# EAGLE schematic moth_v3_54mm_breakout (EAGLE 9.6.2)
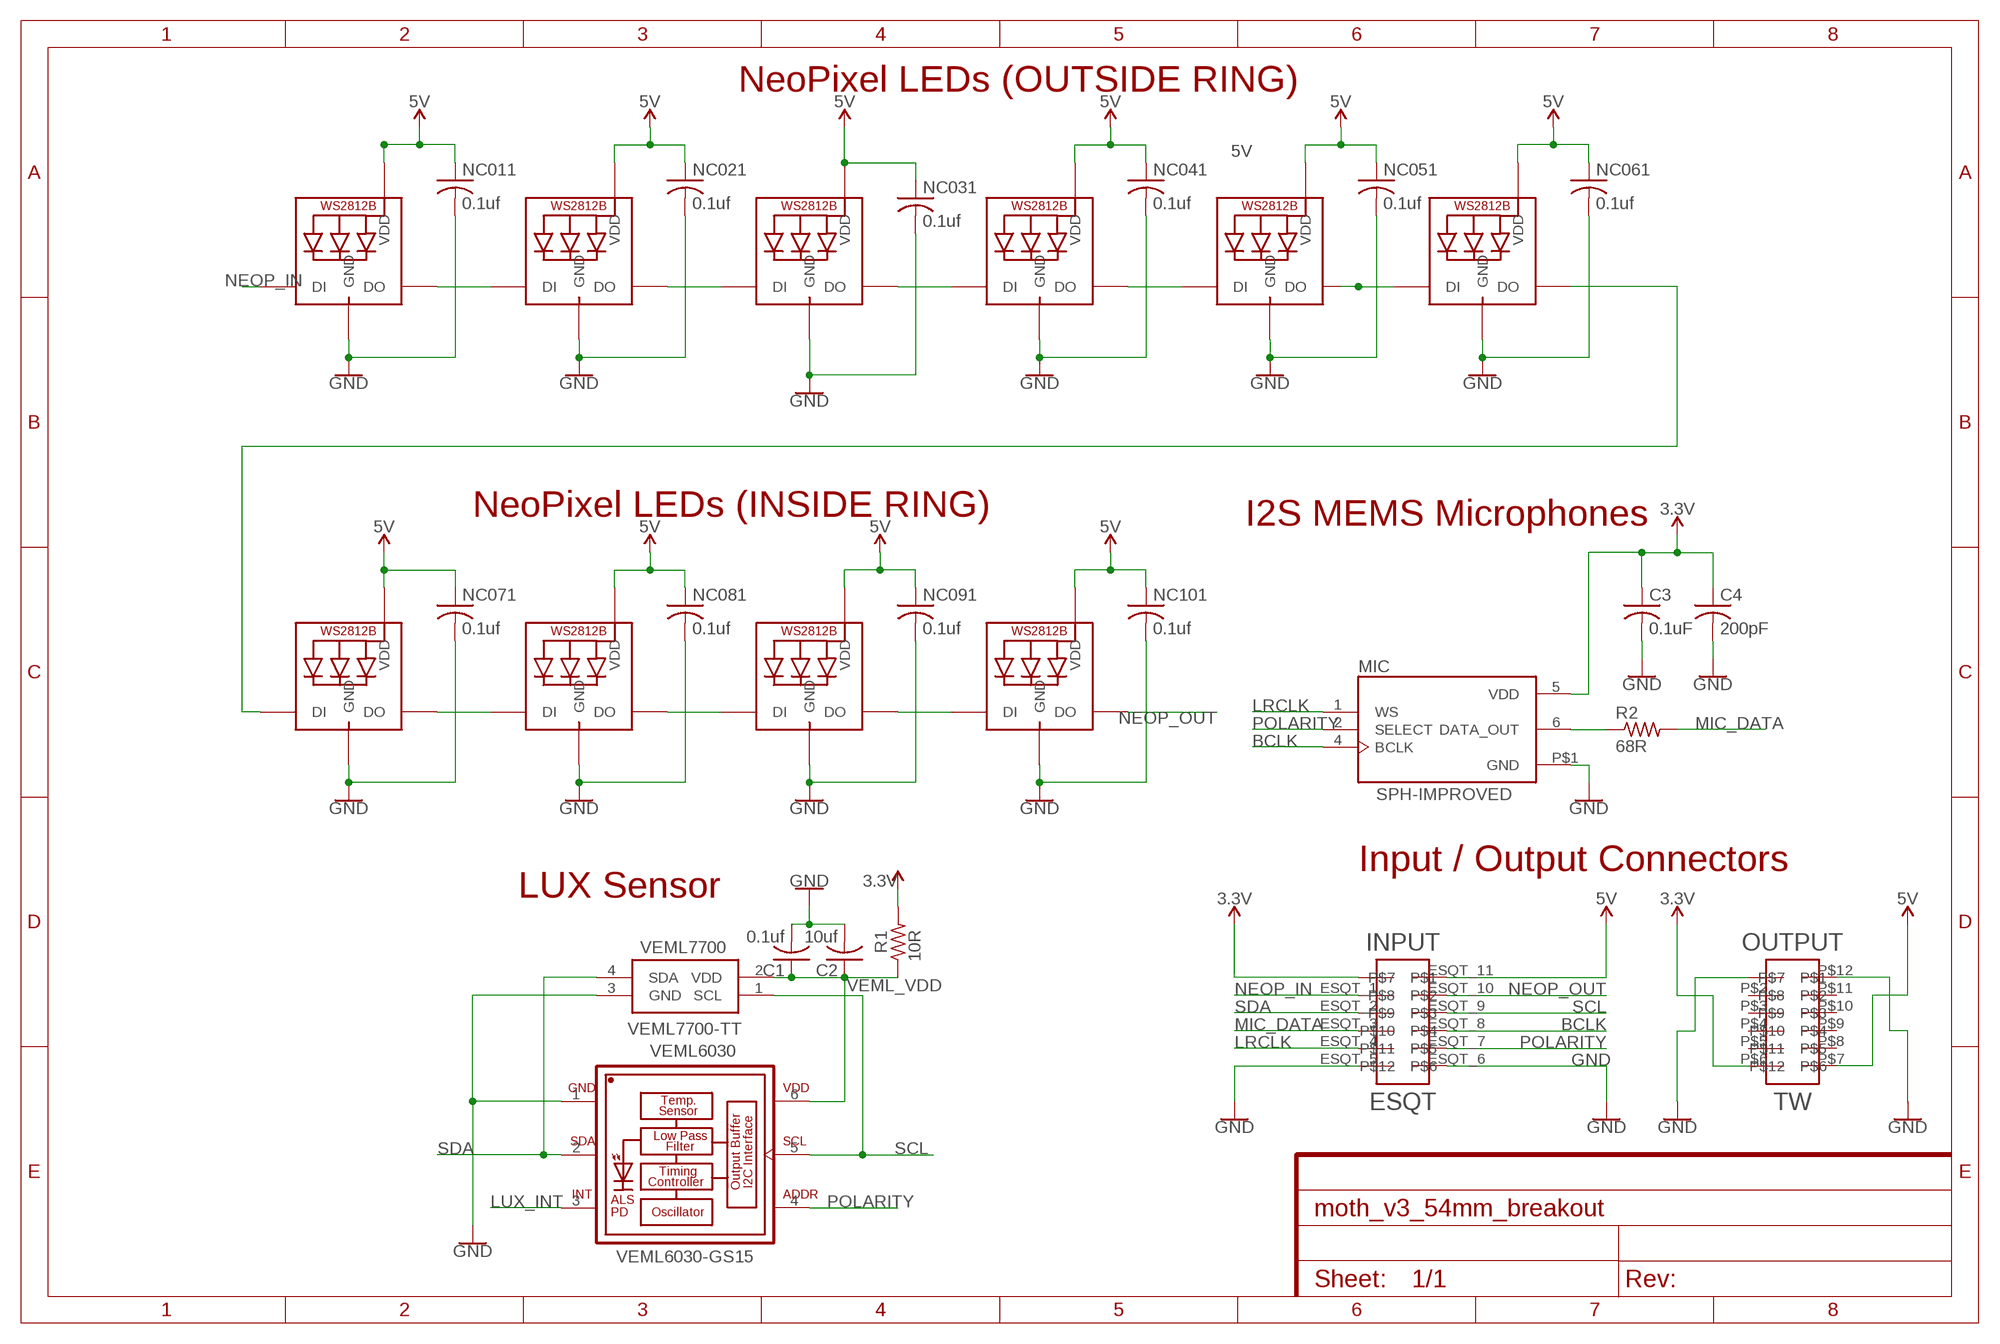
[diagram p0: schematic, sheet 1]

## Parts
C1  0.1uf  C-USC0805  [C0805]
C2  10uf  C-USC0805  [C0805]
C3  0.1uF  C-USC0805  [C0805]
C4  200pF  C-USC0805  [C0805]
INPUT  ESQT  SAMTEC_ESQT_2X6_THROUGH_HOLE  [SAMTEC_ESQT_2X6_THROUGH_HOLE]
MIC  SPH-IMPROVED  [MIC_SPH0645LM4H-B_LARGER_RING]
NC011  0.1uf  C-USC0805K  [C0805K]
NC021  0.1uf  C-USC0805K  [C0805K]
NC031  0.1uf  C-USC0805K  [C0805K]
NC041  0.1uf  C-USC0805K  [C0805K]
NC051  0.1uf  C-USC0805K  [C0805K]
NC061  0.1uf  C-USC0805K  [C0805K]
NC071  0.1uf  C-USC0805K  [C0805K]
NC081  0.1uf  C-USC0805K  [C0805K]
NC091  0.1uf  C-USC0805K  [C0805K]
NC101  0.1uf  C-USC0805K  [C0805K]
NEO1  WS2812B5050  [WS2812B]
NEO2  WS2812B5050  [WS2812B]
NEO3  WS2812B5050  [WS2812B]
NEO4  WS2812B5050  [WS2812B]
NEO5  WS2812B5050  [WS2812B]
NEO6  WS2812B5050  [WS2812B]
NEO07  WS2812B5050  [WS2812B]
NEO08  WS2812B5050  [WS2812B]
NEO9  WS2812B5050  [WS2812B]
NEO10  WS2812B5050  [WS2812B]
OUTPUT  TW  SAMTEC_TW_2X6_WITH_STABLE  [SAMTEC_TW_2X6]
R1  10R  R-US_R0805  [R0805]
R2  68R  R-US_M0805  [M0805]
VEML6030  VEML6030-GS15  [VISHAY_VEML6030_2X2X0.87]
VEML7700  VEML7700-TT  [VEML7700]

## Nets
3.3V: C3.1 C4.1 INPUT.ESQT_0 MIC.5(VDD) OUTPUT.P$6 R1.2
5V: INPUT.ESQT_11 NC011.1 NC021.1 NC031.1 NC041.1 NC051.1 NC061.1 NC071.1 NC081.1 NC091.1 NC101.1 NEO1.1-VDD(VDD) NEO2.1-VDD(VDD) NEO3.1-VDD(VDD) NEO4.1-VDD(VDD) NEO5.1-VDD(VDD) NEO6.1-VDD(VDD) NEO07.1-VDD(VDD) NEO08.1-VDD(VDD) NEO9.1-VDD(VDD) NEO10.1-VDD(VDD) OUTPUT.P$7
1232135: NEO08.2-DOUT(DO) NEO9.4-DIN(DI)
BCLK: INPUT.ESQT_8 MIC.4(BCLK)
GND: C1.2 C2.2 C3.2 C4.2 INPUT.ESQT_5 INPUT.ESQT_6 MIC.P$1(GND) NC011.2 NC021.2 NC031.2 NC041.2 NC051.2 NC061.2 NC071.2 NC081.2 NC091.2 NC101.2 NEO1.3-GND(GND) NEO2.3-GND(GND) NEO3.3-GND(GND) NEO4.3-GND(GND) NEO5.3-GND(GND) NEO6.3-GND(GND) NEO07.3-GND(GND) NEO08.3-GND(GND) NEO9.3-GND(GND) NEO10.3-GND(GND) OUTPUT.P$1 OUTPUT.P$12 VEML6030.1(GND) VEML7700.3(GND)
LRCLK: INPUT.ESQT_4 MIC.1(WS)
LUX_INT: VEML6030.3(INT)
MIC_DATA: INPUT.ESQT_3 R2.2
N$1: NEO3.2-DOUT(DO) NEO4.4-DIN(DI)
N$2: NEO4.2-DOUT(DO) NEO5.4-DIN(DI)
N$3: NEO9.2-DOUT(DO) NEO10.4-DIN(DI)
N$4: NEO07.2-DOUT(DO) NEO08.4-DIN(DI)
N$5: NEO6.2-DOUT(DO) NEO07.4-DIN(DI)
N$10: NEO5.2-DOUT(DO) NEO6.4-DIN(DI)
N$13: NEO1.2-DOUT(DO) NEO2.4-DIN(DI)
N$17: MIC.6(DATA_OUT) R2.1
N$21: NEO2.2-DOUT(DO) NEO3.4-DIN(DI)
NEOP_IN: INPUT.ESQT_1 NEO1.4-DIN(DI)
NEOP_OUT: INPUT.ESQT_10 NEO10.2-DOUT(DO)
POLARITY: INPUT.ESQT_7 MIC.2(SELECT) VEML6030.4(ADDR)
SCL: INPUT.ESQT_9 VEML6030.5(SCL) VEML7700.1(SCL)
SDA: INPUT.ESQT_2 VEML6030.2(SDA) VEML7700.4(SDA)
VEML_VDD: C1.1 C2.1 R1.1 VEML6030.6(VDD) VEML7700.2(VDD)
Unconnected: OUTPUT.P$2 OUTPUT.P$3 OUTPUT.P$4 OUTPUT.P$5 OUTPUT.P$8 OUTPUT.P$9 OUTPUT.P$10 OUTPUT.P$11

## Notes on the sheet
- NeoPixel LEDs (OUTSIDE RING)
- NeoPixel LEDs (INSIDE RING) | I2S MEMS Microphones
- LUX Sensor | Input / Output Connectors
- 10R

## Library data of the parts
C1-C4 NC011 NC021 NC031 NC041 NC051 NC061 NC071 NC081 NC091 NC101 = rcl:C-US: CAPACITOR, American symbol; SPICEPREFIX: C
INPUT = nathans-custom-parts:SAMTEC_ESQT_2X6_THROUGH_HOLE
MIC = SPH0645LM4H-B:SPH-IMPROVED
NEO1-NEO6 NEO07 NEO08 NEO9 NEO10 = adafruit-with-additions:WS2812B
OUTPUT = nathans-custom-parts:SAMTEC_TW_2X6_WITH_STABLE
R1 = audio amplifier example:R-US_: RESISTOR, American symbol
R2 = adafruit:R-US_: RESISTOR, American symbol
VEML6030 = VEML6030-GS15:VEML6030-GS15: VEML6030 High Accuracy Ambient Light Sensor with I2C Interface: VEML6030 is a high accuracy ambient light digital 16-bit resolution sensor in a miniature transparent 2 mm x 2 mm package. It includes a high sensitive photodiode, a low noise amplifier, a 16-bit A/D converter and supports an easy to use I2C bus communication interface and additional interrupt feature. The ambient light result is as digital value available. Device Model created 15.06.2016 by Johannes Kolb - Vishay Semiconductor GmbH; AVAILABILITY: Unavailable; DESCRIPTION: Optical Sensor Ambient 550nm I²C 6-SMD, No Lead; MF: Vishay Semiconductor; MP: VEML6030-GS15; PACKAGE: SMD-6 Vishay; PRICE: None
VEML7700 = VEML7700-TT:VEML7700-TT: 16Bit Ambient Light Sensor I2C 6.8x2.3mm Source: Datasheet <https://www.arrow.com/en/products/veml7700-tt/vishay>; DESCRIPTION: 16Bit Ambient Light Sensor I2C 6.8x2.3mm; HEIGHT: mm; MANUFACTURER_NAME: Vishay; MANUFACTURER_PART_NUMBER: VEML7700-TT; MOUSER_PART_NUMBER: 78-VEML7700-TT; MOUSER_PRICE-STOCK: https://www.mouser.com/Search/Refine.aspx?Keyword=78-VEML7700-TT; RS_PART_NUMBER: 1226791P; RS_PRICE-STOCK: http://uk.rs-online.com/web/p/products/1226791P

## Net classes
0 default: width 0.152 mm, drill 0.254 mm, clearance 0.152 mm